# Altium schematic sheet GPS.SchDoc
size A4; SheetNumber: 4
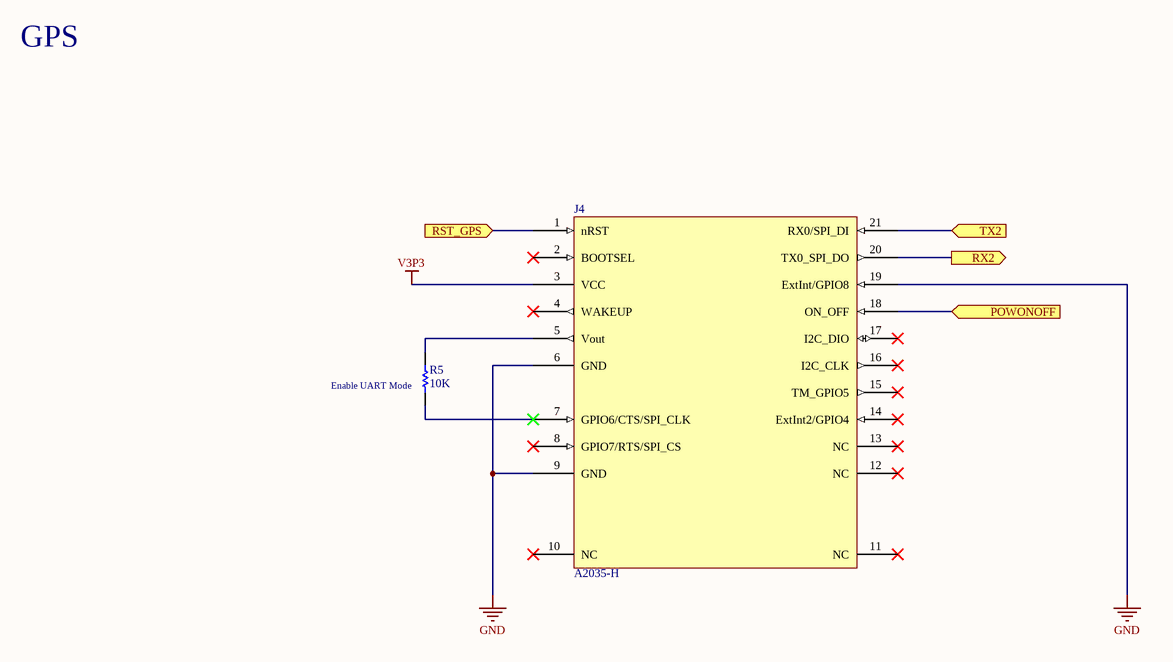
[diagram p0: GPS.SchDoc]

## Parts
J4  A2035-H  [A2035-H]
R5  10K  [own_0603]

## Ports
POWONOFF (in), RST_GPS (in), RX2 (out), TX2 (in)

## Nets
GND: J4.6(GND) J4.9(GND) J4.19(ExtInt/GPIO8)
V3P3: J4.3(VCC)
POWONOFF: J4.18(ON_OFF) ; port POWONOFF
RST_GPS: J4.1(nRST) ; port RST_GPS
RX2: J4.20(TX0_SPI_DO) ; port RX2
TX2: J4.21(RX0/SPI_DI) ; port TX2
NetJ4_5: J4.5(Vout) R5.2
NetJ4_7: J4.7(GPIO6/CTS/SPI_CLK) R5.1

Not connected (* = marked no-connect by the designer): J4 2(BOOTSEL)* 4(WAKEUP)* 8(GPIO7/RTS/SPI_CS)* 10(NC)* 11(NC)* 12(NC)* 13(NC)* 14(ExtInt2/GPIO4)* 15(TM_GPIO5)* 16(I2C_CLK)* 17(I2C_DIO)*

## Notes on the sheet
- GPS
- (near R5) Enable UART Mode

## Library data of the parts
J4 = A2035-H: GPS Module; Fabricant: MAESTRO WIRELESS SOLUTIONS; RefFabricant: A2035H; Fournisseur: Farnell; RefFournisseur: 2281693
R5 = Res1: Resistor; Published: 8-Jun-2000; LatestRevisionDate: 17-Jul-2002; LatestRevisionNote: Re-released for DXP Platform.; PackageReference: AXIAL-0.3; Publisher: Altium Limited; PackageDescription: Axial Device, Thru-Hole; 2 Leads; 0.3 in Pin Spacing